# Altium schematic sheet MCU_Module.SchDoc: MCU Module
size A4; DocumentNumber: 4; SheetNumber: 4; SheetTotal: 50
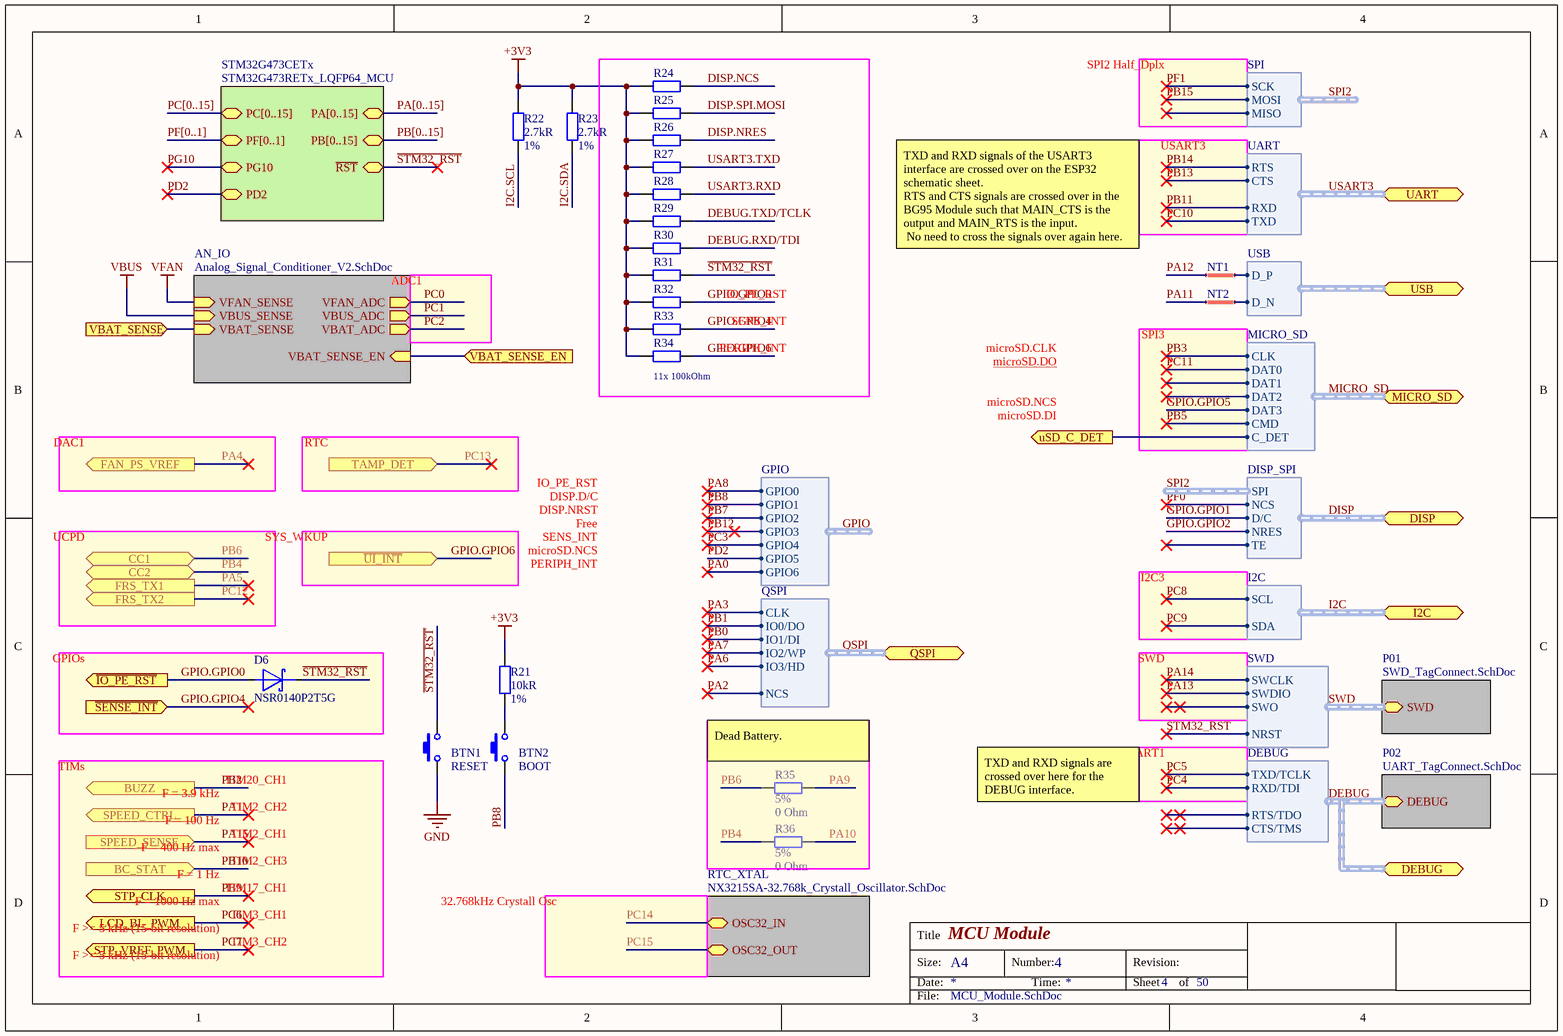
[diagram p0: MCU_Module.SchDoc]

## Parts
BTN1  RESET  [SWITCH USLPT2819DT2TR TACTILE TE]
BTN2  BOOT  [SWITCH USLPT2819DT2TR TACTILE TE]
D6  NSR0140P2T5G  [SODFL100X40-2N]
NT1  Net Tie  [Net Tie 6x30mil]  (value not drawn)  (net tie, no BOM)
NT2  Net Tie  [Net Tie 6x30mil]  (value not drawn)  (net tie, no BOM)
R21  Resistance: 10kR  Tolerance: 1%  [R0402]  (hidden comment: RES SMD 10K OHM 1% 1/16W 0402)
R22  Resistance: 2.7kR  Tolerance: 1%  [R0402]  (hidden comment: RES SMD 2.7K OHM 1% 1/16W 0402)
R23  Resistance: 2.7kR  Tolerance: 1%  [R0402]  (hidden comment: RES SMD 2.7K OHM 1% 1/16W 0402)
R24  RES SMD 100K OHM 1% 1/16W 0402  [R0402]  (value not drawn)
R25  RES SMD 100K OHM 1% 1/16W 0402  [R0402]  (value not drawn)
R26  RES SMD 100K OHM 1% 1/16W 0402  [R0402]  (value not drawn)
R27  RES SMD 100K OHM 1% 1/16W 0402  [R0402]  (value not drawn)
R28  RES SMD 100K OHM 1% 1/16W 0402  [R0402]  (value not drawn)
R29  RES SMD 100K OHM 1% 1/16W 0402  [R0402]  (value not drawn)
R30  RES SMD 100K OHM 1% 1/16W 0402  [R0402]  (value not drawn)
R31  RES SMD 100K OHM 1% 1/16W 0402  [R0402]  (value not drawn)
R32  RES SMD 100K OHM 1% 1/16W 0402  [R0402]  (value not drawn)
R33  RES SMD 100K OHM 1% 1/16W 0402  [R0402]  (value not drawn)
R34  RES SMD 100K OHM 1% 1/16W 0402  [R0402]  (value not drawn)
R35  Tolerance: 5%  Resistance: 0 Ohm  [R0402]  (hidden comment: RES SMD 0 OHM JUMPER 1/16W 0402)
R36  Tolerance: 5%  Resistance: 0 Ohm  [R0402]  (hidden comment: RES SMD 0 OHM JUMPER 1/16W 0402)

## Blocks framed on the sheet
GPIOs: D6

## Sub-sheets
AN_IO = Analog_Signal_Conditioner_V2.SchDoc: VFAN_SENSE (in), VBUS_SENSE (in), VBAT_SENSE (in), VBAT_ADC (out), VFAN_ADC (out), VBUS_ADC (out), VBAT_SENSE_EN (in)
P01 = SWD_TagConnect.SchDoc: SWD (harness SWD)  | Caption: SWD
P02 = UART_TagConnect.SchDoc: DEBUG (harness DEBUG)  | Caption: DEBUG
RTC_XTAL = NX3215SA-32.768k_Crystall_Oscillator.SchDoc: OSC32_OUT, OSC32_IN
STM32G473CETx = STM32G473RETx_LQFP64_MCU: ~{RST} (bidir), PA[0..15] (bidir), PB[0..15] (bidir), PC[0..15] (bidir), PF[0..1] (bidir), PG10 (bidir), PD2 (bidir)

## Ports
BC_STAT (in), BUZZ (out), CC1 (bidir), CC2 (bidir), DEBUG (harness DEBUG), DISP (harness DISP_SPI), FAN_PS_VREF (out), FRS_TX1 (out), FRS_TX2 (out), I2C (harness I2C), LCD_BL_PWM (out), MICRO_SD (harness MICRO_SD), QSPI (harness QSPI), SPEED_CTRL (out), SPEED_SENSE (in), STP_CLK (out), STP_VREF_PWM (out), TAMP_DET (in), UART (harness UART), USB (harness USB), uSD_C_DET (out), VBAT_SENSE (in), VBAT_SENSE_EN (in), ~{IO_PE_RST} (out), ~{SENSE_INT} (in), ~{UI_INT} (in)

## Harnesses
I2C: SCL, SDA
SWD: SWDIO, SWCLK, NRST, SWO
DEBUG: TXD/TCLK, RXD/TDI, RTS/TDO, CTS/TMS
GPIO: GPIO0, GPIO1, GPIO2, GPIO3, GPIO4, GPIO5, GPIO6
DISP_SPI: SPI, NCS, D/C, NRES, TE
MICRO_SD: DAT0, DAT1, DAT2, DAT3, CMD, CLK, C_DET
USB: D_P, D_N
SPI: SCK, MISO, MOSI
QSPI: IO0/DO, IO1/DI, NCS, CLK, IO2/WP, IO3/HD
UART: RTS, CTS, RXD, TXD

## Nets
+3V3: R21.1 R22.2 R23.2 R24.1 R25.1 R26.1 R27.1 R28.1 R29.1 R30.1 R31.1 R32.1 R33.1 R34.1
GND: BTN1.2
VBUS: sheet AN_IO/VBUS_SENSE
VFAN: sheet AN_IO/VFAN_SENSE
~{STM32_RST}: BTN1.1 D6.1(K) R31.2 ; sheet STM32G473CETx/~{RST}, sheet P01/SWD.NRST
DEBUG.RXD/TDI: R30.2
DEBUG.TXD/TCLK: R29.2
DISP.NCS: R24.2
DISP.NRES: R26.2
DISP.SPI.MOSI: R25.2
GPIO.GPIO0: D6.2(A) R32.2 ; port ~{IO_PE_RST}
GPIO.GPIO1: port DISP.D/C  [project net DISP.D/C]
GPIO.GPIO2: port DISP.NRES  [project net DISP.NRES]
GPIO.GPIO4: R33.2 ; port ~{SENSE_INT}
GPIO.GPIO5: port MICRO_SD.DAT3
GPIO.GPIO6: R34.2 ; port ~{UI_INT}
I2C.SCL: R22.1
I2C.SDA: R23.1
MICRO_SD.C_DET: port uSD_C_DET, port MICRO_SD.C_DET
PA0: harness GPIO.GPIO6  [project net GPIO.GPIO6]
PA1: port SPEED_CTRL
PA2: port QSPI.NCS
PA3: port QSPI.CLK
PA4: port FAN_PS_VREF
PA5: port FRS_TX1
PA6: port QSPI.IO3/HD
PA7: port QSPI.IO2/WP
PA8: harness GPIO.GPIO0  [project net GPIO.GPIO0]
PA9: R35.2
PA10: R36.2
PA11: NT2.1
PA12: NT1.1
PA13: sheet P01/SWD.SWDIO
PA14: sheet P01/SWD.SWCLK
PA15: port SPEED_SENSE
PB0: port QSPI.IO1/DI
PB1: port QSPI.IO0/DO
PB2: port BUZZ
PB3: port MICRO_SD.CLK  [project net MICRO_SD.CLK]
PB4: R36.1 ; port CC2
PB5: port MICRO_SD.CMD  [project net MICRO_SD.CMD]
PB6: R35.1 ; port CC1
PB7: harness GPIO.GPIO2  [project net GPIO.GPIO2]
PB8: BTN2.2 ; harness GPIO.GPIO1  [project net GPIO.GPIO1]
PB9: port STP_CLK
PB10: port BC_STAT
PB11: port UART.RXD
PB12: harness GPIO.GPIO3  [project net GPIO.GPIO3]
PB13: port UART.CTS
PB14: port UART.RTS
PB15: harness SPI.MOSI
PC0: sheet AN_IO/VFAN_ADC
PC1: sheet AN_IO/VBUS_ADC
PC2: sheet AN_IO/VBAT_ADC
PC3: harness GPIO.GPIO4  [project net GPIO.GPIO4]
PC4: port DEBUG.RXD/TDI  [project net DEBUG.RXD/TDI]
PC5: port DEBUG.TXD/TCLK  [project net DEBUG.TXD/TCLK]
PC6: port LCD_BL_PWM
PC7: port STP_VREF_PWM
PC8: port I2C.SCL  [project net I2C.SCL]
PC9: port I2C.SDA  [project net I2C.SDA]
PC10: port UART.TXD
PC11: port MICRO_SD.DAT0  [project net MICRO_SD.DAT0]
PC12: port FRS_TX2
PC13: port TAMP_DET
PC14: sheet RTC_XTAL/OSC32_IN
PC15: sheet RTC_XTAL/OSC32_OUT
PD2: sheet STM32G473CETx/PD2, harness GPIO.GPIO5  [project net GPIO.GPIO5]
PF0: port DISP.NCS  [project net DISP.NCS]
PF1: harness SPI.SCK
PG10: sheet STM32G473CETx/PG10
USART3.RXD: R28.2
USART3.TXD: R27.2
VBAT_SENSE: port VBAT_SENSE, sheet AN_IO/VBAT_SENSE
VBAT_SENSE_EN: port VBAT_SENSE_EN, sheet AN_IO/VBAT_SENSE_EN
NetBTN2_1: BTN2.1 R21.2
NetNT1_2: NT1.2 ; port USB.D_P
NetNT2_2: NT2.2 ; port USB.D_N

## Buses and harness runs
bus PA[0..15] = sheet STM32G473CETx/PA[0..15]
bus PB[0..15] = sheet STM32G473CETx/PB[0..15]
bus PC[0..15] = sheet STM32G473CETx/PC[0..15]
bus PF[0..1] = sheet STM32G473CETx/PF[0..1]
harness DEBUG = port DEBUG = sheet P02/DEBUG
harness DISP = port DISP
harness I2C = port I2C
harness MICRO_SD = port MICRO_SD
harness QSPI = port QSPI
harness SWD = sheet P01/SWD
harness USART3 = port UART

## Notes on the sheet
- SPI2 Half_Dplx
- USART3
- TXD and RXD signals of the USART3 interface are crossed over on the ESP32 schematic sheet.
  RTS and CTS signals are crossed over in the BG95 Module such that MAIN_CTS is the output and MAIN_RTS is the input.
  No need to cross the signals over again here.
- ADC1
- IO_PE_RST
- (near R34) 11x 100kOhm
- PERIPH_INT
- SENS_INT
- microSD.CLK
- microSD.DO
- (near NT2) SPI3
- DAC1
- RTC
- microSD.NCS
- microSD.DI
- DISP.D/C
- DISP.NRST
- UCPD
- SYS_WKUP
- Free
- I2C3
- SWD
- TIMs
- TIM20_CH1
- (near R35) Dead Battery.
- USART1
- F = 3.9 kHz
- F = 100 Hz
- F = 400 Hz max
- TIM2_CH1
- TIM2_CH2
- TXD and RXD signals are crossed over here for the DEBUG interface.
- F = 1000 Hz max
- F = 1 Hz
- TIM17_CH1
- TIM3_CH1
- TIM2_CH3
- 32.768kHz Crystall Osc
- F >= 5 kHz (15-bit resolution)
- TIM3_CH2
- Title
- Size:
- Date:
- A4
- Number:
- Time:
- Revision:
- Sheet
- of
- File:

## Library data of the parts
BTN1 BTN2 = TACT ULTRA TB 2.8X1.9X0.6 160GF: Tactile Switch SPST-NO Top Actuated Surface Mount; Manufacturer: TE Connectivity; Manufacturer Part Number: USLPT2819DT2TR; Mechanical Life: 300000Cycles; Operating Force: 160gf; Throw Configuration: SPST; Illumination Type: Non-Illuminated; Switch Travel: 0.13mm; Switch Function: Off-Mom; Actuator Type: Standard; Actuator Material: Nylon,Polyamide; Supplier 1: Digi-Key; Stock 1: 7628; Pricing 1: 1=0.66, 10=0.636, 25=0.612, 100=0.5297, 250=0.4826, 500=0.4473, 1000=0.4002, 2500=0.379 (USD); Mount: Surface Mount; Min Operating Temperature: -40°C; Max Operating Temperature: 85°C; Packaging: Tape and Reel; Termination: SMD/SMT; ComponentLink1URL: https://www.te.com/commerce/DocumentDelivery/DDEController?Action=srchrtrv&amp;DocNm=2337225&amp;DocType=Customer+Drawing&amp;DocLang=English&src-supplier=Digi-Key; ComponentLink1Description: https://www.te.com/commerce/DocumentDelivery/DDEController?Action=srchrtrv&amp;DocNm=2337225&amp;DocType=Customer+Drawing&amp;DocLang=English&src-supplier=Digi-Key; Supplier Part Number 1: 450-3358-1-ND
D6 = DIODE SCHOTTKY 30V 70MA SOD923: Diode Schottky 30V 70mA (DC) Surface Mount SOD-923; Manufacturer: ON Semiconductor; Forward Voltage: 350mV; Max Surge Current: 500mA; Max Power Dissipation: 100mW; Max Reverse Leakage Current: 500nA; Element Configuration: Single; Supplier 1: Digi-Key; Manufacturer Part Number: NSR0140P2T5G; Stock 1: 28802; Pricing 1: 1=0.36, 10=0.27, 25=0.2368, 100=0.1284, 500=0.1048, 1000=0.0777, 2500=0.0683 (USD); Case/Package: SOD-923-2; Number of Pins: 2; Contact Plating: Tin,Matte; Min Operating Temperature: -55°C; Max Operating Temperature: 125°C; Forward Current: 70mA; Package Quantity: 1; Packaging: Tape and Reel; Average Rectified Current: 70mA; Max Repetitive Reverse Voltage (Vrrm): 30V; Peak Reverse Current: 500nA; Power Dissipation: 100mW; Peak Non-Repetitive Surge Current: 500mA; Max Forward Surge Current (Ifsm): 500mA; Termination: SMD/SMT; Max Reverse Voltage (DC): 30V; Length: 0.85mm; Height: 0.43mm; Width: 0.65mm; Radiation Hardening: No; REACH SVHC: No SVHC; Lead Free: Lead Free; ComponentLink1URL: http://www.onsemi.com/pub_link/Collateral/NSR0140P2-D.PDF?src-supplier=Future+Electronics; ComponentLink1Description: http://www.onsemi.com/pub_link/Collateral/NSR0140P2-D.PDF?src-supplier=Future+Electronics; ComponentLink2URL: http://www.farnell.com/datasheets/2353885.pdf?src-supplier=Newark; ComponentLink2Description: http://www.farnell.com/datasheets/2353885.pdf?src-supplier=Newark; ComponentLink3URL: http://www.farnell.com/datasheets/86281.pdf?src-supplier=Element14; ComponentLink3Description: http://www.farnell.com/datasheets/86281.pdf?src-supplier=Element14; ComponentLink4URL: http://www.onsemi.com/pub/Collateral/NSR0140P2-D.PDF?src-supplier=Avnet; ComponentLink4Description: http://www.onsemi.com/pub/Collateral/NSR0140P2-D.PDF?src-supplier=Avnet; ComponentLink5URL: http://www.onsemi.com/pub/Collateral/NSR0140P2-D.PDF?src-supplier=Digi-Key; ComponentLink5Description: http://www.onsemi.com/pub/Collateral/NSR0140P2-D.PDF?src-supplier=Digi-Key; ComponentLink6URL: http://www.mouser.com/ds/2/308/NSR0140P2-D-115172.pdf?src-supplier=Mouser; ComponentLink6Description: http://www.mouser.com/ds/2/308/NSR0140P2-D-115172.pdf?src-supplier=Mouser; Supplier Part Number 1: NSR0140P2T5GOSCT-ND; ClassName: STM32G473CETx; Mount: Surface Mount
NT1 NT2 = Net Tie Line: ClassName: STM32G473CETx
R21 = RES SMD 10K OHM 1% 1/16W 0402: 10 kOhms ±1% 0.063W, 1/16W Chip Resistor 0402 (1005 Metric) Moisture Resistant Thick Film; Manufacturer Part Number: RC0402FR-0710KP; Manufacturer: Yageo; Temperature Coefficient: 150ppm/°C; Max Power Dissipation: 63mW; Supplier 1: Digi-Key; Stock 1: 839368; Pricing 1: 1=0.1, 10=0.035, 100=0.014, 1000=0.0063, 2500=0.0055, 5000=0.0045 (USD); Case Code (Imperial): 0402; Case Code (Metric): 1005; Min Operating Temperature: -55°C; Max Operating Temperature: 155°C; Composition: Thick Film; Packaging: Tape and Reel; Number of Terminations: 2; Length: 0.039inch; Height: 0.016inch; Width: 0.02inch; ComponentLink1URL: http://www.yageo.com/NewPortal/yageodocoutput?fileName=/pdf/R-Chip/PYu-RC_51_RoHS_P_0.pdf&src-supplier=Digi-Key; ComponentLink1Description: http://www.yageo.com/NewPortal/yageodocoutput?fileName=/pdf/R-Chip/PYu-RC_51_RoHS_P_0.pdf&src-supplier=Digi-Key; Supplier Part Number 1: YAG1249CT-ND; Case/Package: 0402; Features: Moisture Resistant; ClassName: STM32G473CETx; Mount: Surface Mount
R22 R23 = RES SMD 2.7K OHM 1% 1/16W 0402: 2.7 kOhms ±1% 0.063W, 1/16W Chip Resistor 0402 (1005 Metric) Moisture Resistant Thick Film; Manufacturer: Yageo; Manufacturer Part Number: RC0402FR-072K7L; Power Rating: 63mW; Temperature Coefficient: 100ppm/°C; Voltage Rating: 50V; Supplier 1: Digi-Key; Stock 1: 261850; Pricing 1: 1=0.1, 10=0.016, 100=0.0064, 1000=0.0029, 2500=0.0025, 5000=0.0021 (USD); Case/Package: 0402; Case Code (Imperial): 0402; Case Code (Metric): 1005; Min Operating Temperature: -55°C; Max Operating Temperature: 155°C; Packaging: Tape and Reel; Package Quantity: 1; Termination: SMD/SMT; Composition: Thick Film; Number of Terminations: 2; Military Standard: Not; Max Power Dissipation: 63mW; Features: Moisture Resistant; Working Voltage: 50V; Length: 1mm; Height: 0.016inch; Width: 0.02inch; Depth: 0.5mm; REACH SVHC: Unknown; Lead Free: Lead Free; ComponentLink1URL: http://www.mouser.com/ds/2/447/PYu-RC0402_51_RoHS_L_6_r-8721.pdf?src-supplier=Mouser; ComponentLink1Description: http://www.mouser.com/ds/2/447/PYu-RC0402_51_RoHS_L_6_r-8721.pdf?src-supplier=Mouser; ComponentLink2URL: http://www.yageo.com/documents/recent/PYu-RC_Group_51_RoHS_L_9.pdf?src-supplier=Digi-Key; ComponentLink2Description: http://www.yageo.com/documents/recent/PYu-RC_Group_51_RoHS_L_9.pdf?src-supplier=Digi-Key; ComponentLink3URL: http://www.yageo.com/documents/recent/PYu-RC_Group_51_RoHS_L_10.pdf?src-supplier=Digi-Key; ComponentLink3Description: http://www.yageo.com/documents/recent/PYu-RC_Group_51_RoHS_L_10.pdf?src-supplier=Digi-Key; ComponentLink4URL: http://www.farnell.com/datasheets/2167052.pdf?src-supplier=Element14; ComponentLink4Description: http://www.farnell.com/datasheets/2167052.pdf?src-supplier=Element14; Supplier Part Number 1: 311-2.70KLRCT-ND; ClassName: STM32G473CETx; Mount: Surface Mount
R24-R34 = RES SMD 100K OHM 1% 1/16W 0402: 100 kOhms ±1% 0.063W, 1/16W Chip Resistor 0402 (1005 Metric) Moisture Resistant Thick Film; Manufacturer: Yageo; Manufacturer Part Number: RC0402FR-07100KL; Temperature Coefficient: 100ppm/°C; Power Rating: 63mW; Voltage Rating: 50V; Supplier 1: Digi-Key; Stock 1: 47448883; Pricing 1: 1=0.1, 10=0.016, 100=0.0064, 1000=0.0029, 2500=0.0025, 5000=0.0021 (USD); Case Code (Metric): 1005; Case Code (Imperial): 0402; Min Operating Temperature: -55°C; Max Operating Temperature: 155°C; Composition: Thick Film; Packaging: Tape and Reel; Termination: SMD/SMT; Military Standard: Not; Length: 0.039inch; Height: 0.016inch; Width: 0.02inch; Depth: 0.5mm; Lead Free: Lead Free; ComponentLink1URL: http://www.yageo.com/documents/recent/PYu-RC_Group_51_RoHS_L_10.pdf?src-supplier=Digi-Key; ComponentLink1Description: http://www.yageo.com/documents/recent/PYu-RC_Group_51_RoHS_L_10.pdf?src-supplier=Digi-Key; ComponentLink2URL: http://www.farnell.com/datasheets/1018594.pdf?src-supplier=Element14; ComponentLink2Description: http://www.farnell.com/datasheets/1018594.pdf?src-supplier=Element14; ComponentLink3URL: http://www.yageo.com/documents/recent/PYu-RC_Group_51_RoHS_L_9.pdf?src-supplier=Verical; ComponentLink3Description: http://www.yageo.com/documents/recent/PYu-RC_Group_51_RoHS_L_9.pdf?src-supplier=Verical; Supplier Part Number 1: 311-100KLRDKR-ND; Case/Package: 0402; Tolerance: 1%; Resistance: 100 kOhm; Package Quantity: 1; Number of Terminations: 2; Max Power Dissipation: 63mW; Working Voltage: 50V; Features: Moisture Resistant; REACH SVHC: No SVHC; ComponentLink4URL: http://www.yageo.com/documents/recent/PYu-RC_Group_51_RoHS_L_9.pdf?src-supplier=Mouser; ComponentLink4Description: http://www.yageo.com/documents/recent/PYu-RC_Group_51_RoHS_L_9.pdf?src-supplier=Mouser; ComponentLink5URL: http://documents.rs-components.com/techlib://itc_doclist_GB.htm?stockno=6185797&src-supplier=RSComponents; ComponentLink5Description: http://documents.rs-components.com/techlib://itc_doclist_GB.htm?stockno=6185797&src-supplier=RSComponents; Mount: Surface Mount
R35 R36 = RES SMD 0 OHM JUMPER 1/16W 0402: 0 Ohms Jumper 0.063W, 1/16W Chip Resistor 0402 (1005 Metric) Moisture Resistant Thick Film; Manufacturer: Yageo; Manufacturer Part Number: RC0402JR-070RL; Power Rating: 62.5mW; Voltage Rating: 50V; Max Power Dissipation: 63mW; Temperature Coefficient: 200ppm/°C; Case/Package: 0402; Supplier 1: Digi-Key; Stock 1: 46057148; Pricing 1: 1=0.1, 10=0.013, 25=0.0092, 50=0.0072, 100=0.0053, 250=0.004, 500=0.0032, 1000=0.0024, 5000=0.0017 (USD); Contact Plating: Tin,Matte; Case Code (Metric): 1005; Case Code (Imperial): 0402; Min Operating Temperature: -55°C; Max Operating Temperature: 155°C; Packaging: Tape and Reel; Composition: Thick Film; Package Quantity: 1; Number of Terminations: 2; Termination: SMD/SMT; Military Standard: Not; Features: Moisture Resistant; Length: 1mm; Height: 0.016inch; Width: 0.02inch; Depth: 0.5mm; Radiation Hardening: No; REACH SVHC: Unknown; Lead Free: Lead Free; ComponentLink1URL: http://www.yageo.com/documents/recent/PYu-RC_Group_51_RoHS_L_10.pdf?src-supplier=Digi-Key; ComponentLink1Description: http://www.yageo.com/documents/recent/PYu-RC_Group_51_RoHS_L_10.pdf?src-supplier=Digi-Key; ComponentLink2URL: http://www.yageo.com/documents/recent/PYu-RC0402_51_RoHS_L_6.pdf?src-supplier=Avnet+Europe; ComponentLink2Description: http://www.yageo.com/documents/recent/PYu-RC0402_51_RoHS_L_6.pdf?src-supplier=Avnet+Europe; ComponentLink3URL: http://www.farnell.com/datasheets/1018594.pdf?src-supplier=Element14; ComponentLink3Description: http://www.farnell.com/datasheets/1018594.pdf?src-supplier=Element14; ComponentLink4URL: https://www.verical.com/server-webapp/html/getDatasheet?partID=326379&src-supplier=Verical; ComponentLink4Description: https://www.verical.com/server-webapp/html/getDatasheet?partID=326379&src-supplier=Verical; ComponentLink5URL: http://www.farnell.com/datasheets/2167052.pdf?src-supplier=Element14; ComponentLink5Description: http://www.farnell.com/datasheets/2167052.pdf?src-supplier=Element14; Supplier Part Number 1: 311-0.0JRCT-ND; ClassName: STM32G473CETx; Mount: Surface Mount